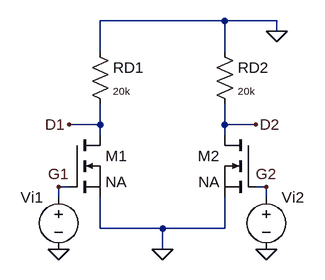
[diagram p0: schematic DifferentialAmplifierSmallSignal.asc]
DifferentialAmplifierSmallSignal.asc, the LTspice schematic file:
Version 4
SHEET 1 880 680
WIRE 448 -80 256 -80
WIRE 528 -80 448 -80
WIRE 528 -64 528 -80
WIRE 256 -32 256 -80
WIRE 448 -32 448 -80
WIRE 256 80 256 48
WIRE 256 80 208 80
WIRE 448 80 448 48
WIRE 496 80 448 80
WIRE 256 96 256 80
WIRE 448 96 448 80
WIRE 208 176 192 176
WIRE 512 176 496 176
WIRE 192 192 192 176
WIRE 512 192 512 176
WIRE 256 240 256 192
WIRE 352 240 256 240
WIRE 448 240 448 192
WIRE 448 240 352 240
WIRE 352 272 352 240
FLAG 208 80 D1
FLAG 496 80 D2
FLAG 192 272 0
FLAG 512 272 0
FLAG 192 176 G1
FLAG 512 176 G2
FLAG 528 -64 0
FLAG 352 272 0
SYMBOL nmos 208 96 R0
SYMATTR InstName M1
SYMATTR Value NA
SYMBOL res 240 -48 R0
WINDOW 3 36 76 Left 1
SYMATTR Value 20k
SYMATTR InstName RD1
SYMBOL res 432 -48 R0
WINDOW 3 36 76 Left 1
SYMATTR Value 20k
SYMATTR InstName RD2
SYMBOL voltage 512 176 R0
WINDOW 3 24 96 Invisible 2
SYMATTR InstName Vi2
SYMBOL nmos 496 96 M0
SYMATTR InstName M2
SYMATTR Value NA
SYMBOL voltage 192 176 M0
WINDOW 3 24 96 Invisible 2
SYMATTR InstName Vi1

The netlist it stands for:
* DifferentialAmplifierSmallSignal.asc
M1 D1 G1 0 0 NA
RD1 0 D1 20k
RD2 0 D2 20k
Vi2 G2 0 V
M2 D2 G2 0 0 NA
Vi1 G1 0 V
.model NMOS NMOS
.model PMOS PMOS
.lib standard.mos
.backanno
.end